# Altium project UZ_CarrierBoard.PrjPcb (part 6 of 10)

## Sheet isoDebug-FTDI.SchDoc
size A4; Organization: UltraZohm; SheetNumber: 32; SheetTotal: 40
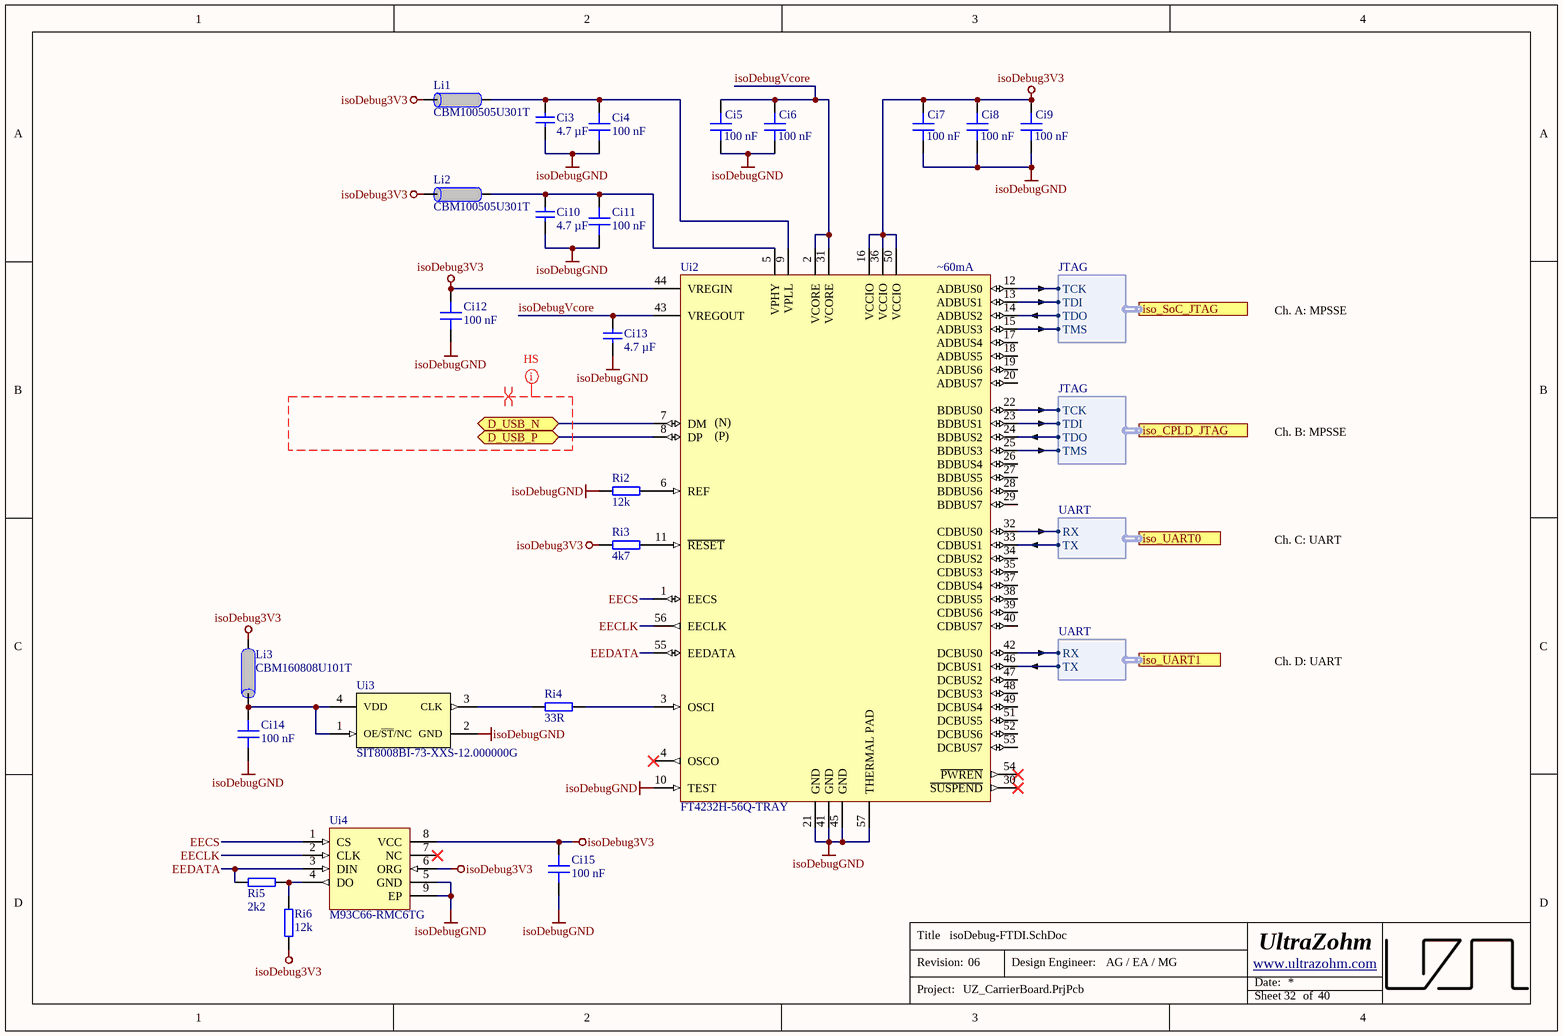
[diagram p19: isoDebug-FTDI.SchDoc]

### Parts
Ci3  4.7 µF  [C_0603_TE]
Ci4  100 nF  [C_0402_TE]
Ci5  100 nF  [C_0402_TE]
Ci6  100 nF  [C_0402_TE]
Ci7  100 nF  [C_0402_TE]
Ci8  100 nF  [C_0402_TE]
Ci9  100 nF  [C_0402_TE]
Ci10  4.7 µF  [C_0603_TE]
Ci11  100 nF  [C_0402_TE]
Ci12  100 nF  [C_0402_TE]
Ci13  4.7 µF  [C_0603_TE]
Ci14  100 nF  [C_0402_TE]
Ci15  100 nF  [C_0402_TE]
Li1  CBM100505U301T  [IND_0402_TE]
Li2  CBM100505U301T  [IND_0402_TE]
Li3  CBM160808U101T  [IND_0603_TE]
Ri2  12k  [R_0603_TE]
Ri3  4k7  [R_0603_TE]
Ri4  33R  [R_0603_TE]
Ri5  2k2  [R_0603_TE]
Ri6  12k  [R_0603_TE]
Ui2  FT4232H-56Q-TRAY  [QFN50P800X800-57T610X610N]
Ui3  SIT8008BI-73-XXS-12.000000G  [2016]
Ui4  M93C66-RMC6TG  [UFDFPN8]

### Ports
D_USB_N (bidir), D_USB_P (bidir), iso_CPLD_JTAG (harness JTAG), iso_SoC_JTAG (harness JTAG), iso_UART0 (harness UART), iso_UART1 (harness UART)

### Harnesses
JTAG: TCK, TDI, TDO, TMS
UART: RX, TX

### Nets
isoDebug3V3: Ci7.2 Ci8.2 Ci9.2 Ci12.2 Ci15.2 Li1.2 Li2.2 Li3.1 Ri3.1 Ri6.1 Ui2.16(VCCIO) Ui2.36(VCCIO) Ui2.44(VREGIN) Ui2.50(VCCIO) Ui4.6(ORG) Ui4.8(VCC)
isoDebugGND: Ci3.1 Ci4.1 Ci5.1 Ci6.1 Ci7.1 Ci8.1 Ci9.1 Ci10.1 Ci11.1 Ci12.1 Ci13.1 Ci14.1 Ci15.1 Ri2.1 Ui2.10(TEST) Ui2.21(GND) Ui2.41(GND) Ui2.45(GND) Ui2.57(THERMAL_PAD) Ui3.2(GND) Ui4.5(GND) Ui4.9(EP)
D_USB_N: Ui2.7(DM) ; port D_USB_N
D_USB_P: Ui2.8(DP) ; port D_USB_P
EECLK: Ui2.56(EECLK) Ui4.2(CLK)
EECS: Ui2.1(EECS) Ui4.1(CS)
EEDATA: Ri5.1 Ui2.55(EEDATA) Ui4.3(DIN)
isoDebugVcore: Ci5.2 Ci6.2 Ci13.2 Ui2.2(VCORE) Ui2.31(VCORE) Ui2.43(VREGOUT)
NetCi3_2: Ci3.2 Ci4.2 Li1.1 Ui2.9(VPLL)
NetCi10_2: Ci10.2 Ci11.2 Li2.1 Ui2.5(VPHY)
NetCi14_2: Ci14.2 Li3.2 Ui3.1(OE/~{ST}/NC) Ui3.4(VDD)
NetRi2_2: Ri2.2 Ui2.6(REF)
NetRi3_2: Ri3.2 Ui2.11(~{RESET})
NetRi4_1: Ri4.1 Ui3.3(CLK)
NetRi4_2: Ri4.2 Ui2.3(OSCI)
NetRi5_2: Ri5.2 Ri6.2 Ui4.4(DO)
NetUi2_12: Ui2.12(ADBUS0) ; port iso_SoC_JTAG.TCK
NetUi2_13: Ui2.13(ADBUS1) ; port iso_SoC_JTAG.TDI
NetUi2_14: Ui2.14(ADBUS2) ; port iso_SoC_JTAG.TDO
NetUi2_15: Ui2.15(ADBUS3) ; port iso_SoC_JTAG.TMS
NetUi2_22: Ui2.22(BDBUS0) ; port iso_CPLD_JTAG.TCK
NetUi2_23: Ui2.23(BDBUS1) ; port iso_CPLD_JTAG.TDI
NetUi2_24: Ui2.24(BDBUS2) ; port iso_CPLD_JTAG.TDO
NetUi2_25: Ui2.25(BDBUS3) ; port iso_CPLD_JTAG.TMS
NetUi2_32: Ui2.32(CDBUS0) ; port iso_UART0.RX
NetUi2_33: Ui2.33(CDBUS1) ; port iso_UART0.TX
NetUi2_42: Ui2.42(DCBUS0) ; port iso_UART1.RX
NetUi2_46: Ui2.46(DCBUS1) ; port iso_UART1.TX

Not connected (* = marked no-connect by the designer): Ui2 4(OSCO)* 17(ADBUS4) 18(ADBUS5) 19(ADBUS6) 20(ADBUS7) 26(BDBUS4) 27(BDBUS5) 28(BDBUS6) 29(BDBUS7) 30(~{SUSPEND})* 34(CDBUS2) 35(CDBUS3) 37(CDBUS4) 38(CDBUS5) 39(CDBUS6) 40(CDBUS7) 47(DCBUS2) 48(DCBUS3) 49(DCBUS4) 51(DCBUS5) 52(DCBUS6) 53(DCBUS7) 54(~{PWREN})*; Ui4 7(NC)*

### Layout directives
differential pair: (no net found under the mark)
net class HS: (no net found under the mark)

### Notes on the sheet
- (near Ui2) ~60mA
- Ch. A: MPSSE
- Ch. B: MPSSE
- Ch. C: UART
- Ch. D: UART
- Title
- Revision:
- Design Engineer:
- Date:
- Project:
- Sheet
- of
- (in symbol FT4232H-56Q-TRAY) (N); (P)

### Library data of the parts
Ci3 Ci10 Ci13 = UZgen_C_0603_4.7uF_16V_X5R: as C11 on sheet ETH-PHY; Manufacturer Part Number: UZgen_C_0603_4.7uF_16V_X5R; PartID: 5809; Created On: 20/03/2025 14:43:45; Device Package: 0603; Last Updated: 20/03/2025 14:43:45; Mounting Type: SMD; Value: 4.7 µF; Technology: X5R
Ci4-Ci9 Ci11 Ci12 Ci14 Ci15 = GRM155R71H104KE14D: 50V 100nF X7R ±10% 0402 Multilayer Ceramic Capacitors MLCC - SMD/SMT ROHS; Manufacturer: Murata Electronics; Voltage Rating: 50 VDC; Created from: AGeiger; Manufacturer Part Number: GRM155R71H104KE14D; PartID: 144; Created On: 13.12.2023 22:03:54; ComponentLink1Description: Datasheet; ComponentLink1URL: https://datasheet.lcsc.com/lcsc/1809272047_Murata-Electronics-GRM155R71H104KE14D_C77020.pdf; Component Type: Capacitor 0402; Device Package: 0402; Last Updated: 13.12.2023 22:03:54; Mounting Type: SMD; Operating Temperature: -55 to +125°C; Series: X7R; Supplier 1: LCSC; Supplier Part Number 1: C77020; Type: Capacitor; Tolerance: 10 %; Value: 100 nF; Live Cycle Status: 1; LCSC Part Number: C77020
Li1 Li2 = CBM100505U301T: 300mΩ ±25% 300Ω@100MHz 0402 Ferrite Beads ROHS; Manufacturer: FH (Guangdong Fenghua Advanced Tech); DC current: 0.6 A; Value: 300 mOhm; Created from: AGeiger; Manufacturer Part Number: CBM100505U301T; PartID: 20; Created On: 13.12.2023 22:24:41; ComponentLink1Description: Datasheet; ComponentLink1URL: https://datasheet.lcsc.com/lcsc/2304140030_FH--Guangdong-Fenghua-Advanced-Tech-CBM100505U301T_C394406.pdf; Component Type: Ferrite Beads; Device Package: 0402; Last Updated: 13.12.2023 22:24:41; Mounting Type: SMD; Operating Temperature: -40 to +85°C; Supplier 1: LCSC; Supplier Part Number 1: C394406; Type: Ferrite Bead; Live Cycle Status: 1; LCSC Part Number: C394406
Li3 = CBM160808U101T: 60mΩ ±25% 100Ω@100MHz 0603 Ferrite Beads ROHS; Manufacturer: FH (Guangdong Fenghua Advanced Tech); DC current: 2.5 A; Value: 60 mOhm; Created from: AGeiger; Manufacturer Part Number: CBM160808U101T; PartID: 21; Created On: 13.12.2023 22:36:14; ComponentLink1Description: Datasheet; ComponentLink1URL: https://datasheet.lcsc.com/lcsc/1912111437_FH--Guangdong-Fenghua-Advanced-Tech-CBM160808U101T_C361675.pdf; Component Type: Ferrite Beads; Device Package: 0603; Last Updated: 13.12.2023 22:36:14; Mounting Type: SMD; Operating Temperature: -40 to +85°C; Supplier 1: LCSC; Supplier Part Number 1: C361675; Type: Ferrite Bead; Live Cycle Status: 1; LCSC Part Number: C361675
Ri2 Ri6 = UZgen_R_0603_12k: Generic resistor; Manufacturer: UZgen; Tolerance: 1 %; Created from: UZgenTool; Manufacturer Part Number: UZgen_R_0603_12k; PartID: 246; Created On: 02/07/2024 17:29:50; Device Package: 0603; Last Updated: 02/07/2024 17:29:50; Mounting Type: SMD; Value: 12k
Ri3 = UZgen_R_0603_4k7: Generic resistor; Manufacturer: UZgen; Tolerance: 1 %; Created from: UZgenTool; Manufacturer Part Number: UZgen_R_0603_4k7; PartID: 237; Created On: 02/07/2024 17:29:50; Device Package: 0603; Last Updated: 02/07/2024 17:29:50; Mounting Type: SMD; Value: 4k7
Ri4 = UZgen_R_0603_33R: as R49 on sheet ETH-PHY; Manufacturer Part Number: UZgen_R_0603_33R; PartID: 185; Created On: 02/07/2024 17:29:48; Device Package: 0603; Last Updated: 02/07/2024 17:29:48; Mounting Type: SMD; Value: 33R
Ri5 = UZgen_R_0603_2k2: Generic resistor; Manufacturer: UZgen; Tolerance: 1 %; Created from: UZgenTool; Manufacturer Part Number: UZgen_R_0603_2k2; PartID: 229; Created On: 02/07/2024 17:29:49; Device Package: 0603; Last Updated: 02/07/2024 17:29:49; Mounting Type: SMD; Value: 2k2
Ui2 = FT4232H-56Q-TRAY: USB Interface IC Quad 480Mbs 4 UART USB 2.0 12Mbit; Manufacturer: FTDI; Created from: AGeiger; PartID: 1; Created On: 26.11.2023 16:58:07; ComponentLink1Description: Datasheet; ComponentLink1URL: https://www.mouser.de/datasheet/2/163/DS_FT4232H-1621254.pdf; Component Type: USB Controller; Device Package: VQFN-56; Last Updated: 26.11.2023 16:58:07; Manufacturer Part Number: FT4232H-56Q-TRAY; Mounting Type: SMD; Operating Temperature: -40 to 85 °C; Series: FT4232H; Supplier 1: Mouser; Supplier Part Number 1: 895-FT4232H-56Q-TRAY; Value: FT4232H-56Q-TRAY; LCSC Part Number: C1521561
Ui3 = SIT8008BI-73-XXS-12.000000G: Clock-Standardoszillatoren -40 to 85C, 2016, 50ppm, 2.25V-3.63V, 12MHz, ST, 250 pcs T&R 8 mm; Manufacturer: SiTime; Created from: AGeiger; Manufacturer Part Number: SIT8008BI-73-XXS-12.000000G; PartID: 2; Created On: 11.01.2024 17:02:48; ComponentLink1Description: Datasheet; ComponentLink1URL: https://www.mouser.de/datasheet/2/371/SiT8008B_datasheet-1291019.pdf; Component Type: Oscillator; Device Package: 2016; Last Updated: 11.01.2024 17:02:48; Mounting Type: SMD; Operating Temperature: -40 to +85 °C; Supplier 1: Mouser; Supplier Part Number 1: 788-8008BI73XXS120G; Value: 12 MHz; LCSC Part Number: C1508636
Ui4 = M93C66-RMC6TG: 4Kbit MICROWIRE EE 1.8 V to 5.5 V; Manufacturer: STMicroelectronics; Created from: AGeiger; Manufacturer Part Number: M93C66-RMC6TG; PartID: 2; Created On: 19.11.2023 15:06:30; ComponentLink1Description: Datasheet; ComponentLink1URL: https://www.mouser.de/datasheet/2/389/m93c46_w-1849748.pdf; Component Type: EEPROM; Device Package: UFDFPN-8; Last Updated: 19.11.2023 21:39:04; Mounting Type: SMD; Operating Temperature: -40 to +85 °C; Series: M93xxx; Supplier 1: Mouser; Supplier Part Number 1: 511-M93C66-RMC6TG; Supplier 2: LCSC; Supplier Part Number 2: C2061956; Type: Memory; Value: M93C66-RMC6TG; LCSC Part Number: C2061956

## Sheet isoDebug-Isolation.SchDoc
size A4; Organization: UltraZohm
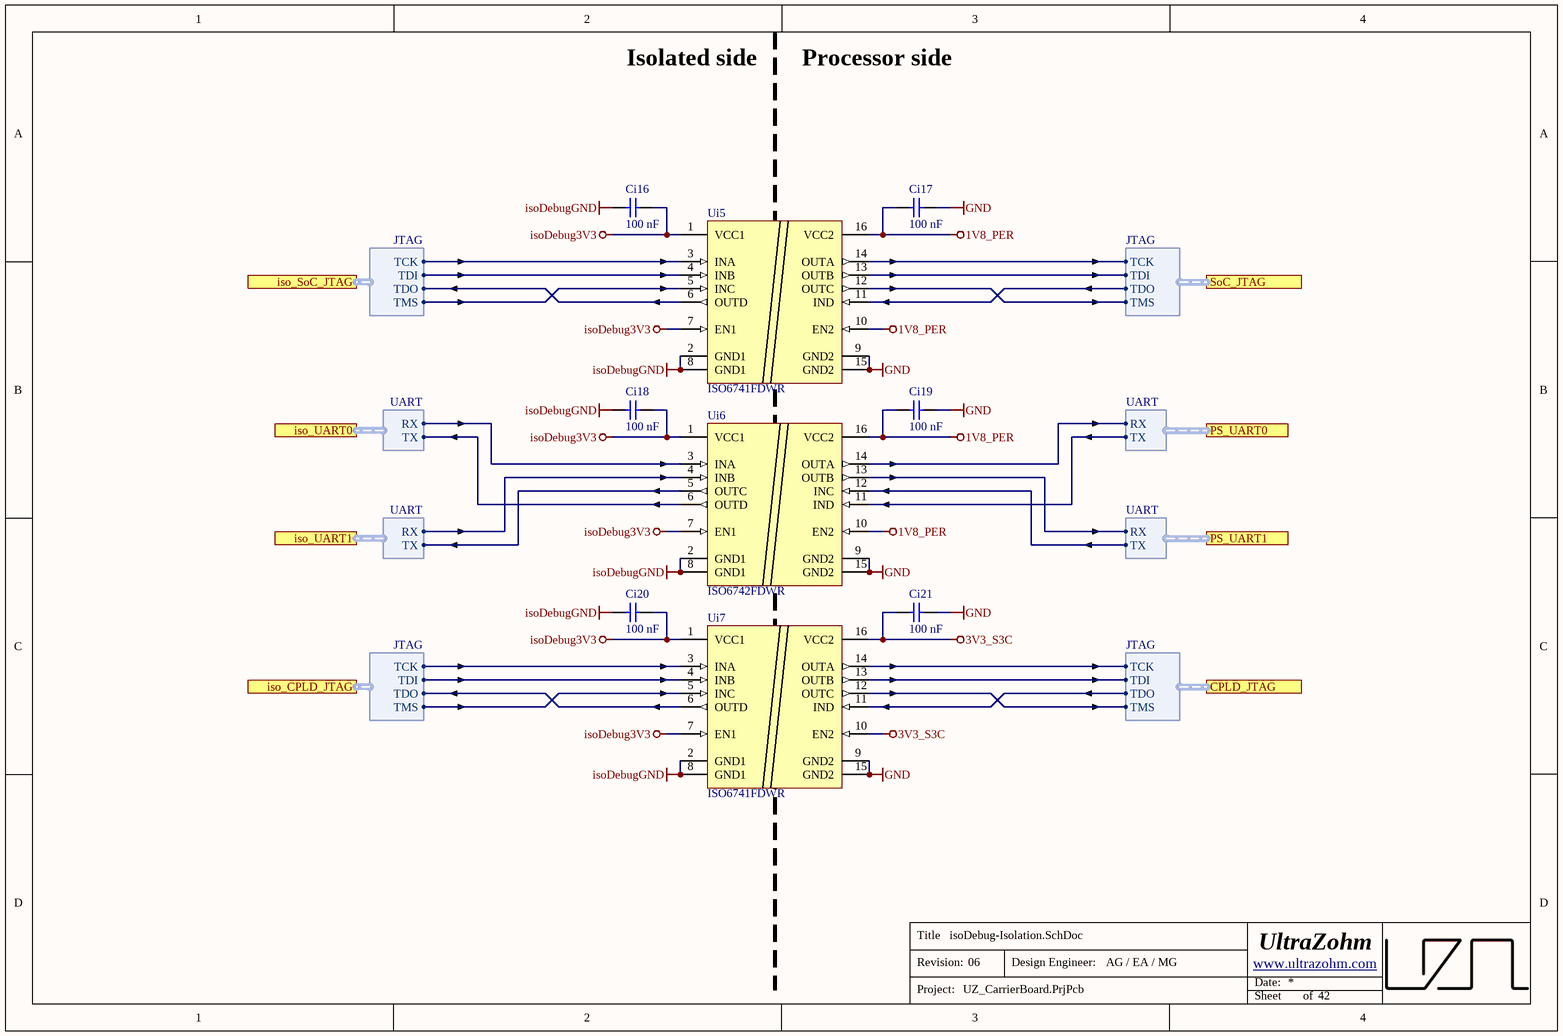
[diagram p20: isoDebug-Isolation.SchDoc]

### Parts
Ci16  100 nF  [C_0402_TE]
Ci17  100 nF  [C_0402_TE]
Ci18  100 nF  [C_0402_TE]
Ci19  100 nF  [C_0402_TE]
Ci20  100 nF  [C_0402_TE]
Ci21  100 nF  [C_0402_TE]
Ui5  ISO6741FDWR  [SOIC127P1030X265-16N]
Ui6  ISO6742FDWR  [SOIC127P1030X265-16N]
Ui7  ISO6741FDWR  [SOIC127P1030X265-16N]

### Ports
CPLD_JTAG (harness JTAG), iso_CPLD_JTAG (harness JTAG), iso_SoC_JTAG (harness JTAG), iso_UART0 (harness UART), iso_UART1 (harness UART), PS_UART0 (harness UART), PS_UART1 (harness UART), SoC_JTAG (harness JTAG)

### Harnesses
JTAG: TCK, TDI, TDO, TMS
UART: RX, TX

### Nets
1V8_PER: Ci17.2 Ci19.2 Ui5.10(EN2) Ui5.16(VCC2) Ui6.10(EN2) Ui6.16(VCC2)
3V3_S3C: Ci21.2 Ui7.10(EN2) Ui7.16(VCC2)
GND: Ci17.1 Ci19.1 Ci21.1 Ui5.9(GND2) Ui5.15(GND2) Ui6.9(GND2) Ui6.15(GND2) Ui7.9(GND2) Ui7.15(GND2)
isoDebug3V3: Ci16.1 Ci18.1 Ci20.1 Ui5.1(VCC1) Ui5.7(EN1) Ui6.1(VCC1) Ui6.7(EN1) Ui7.1(VCC1) Ui7.7(EN1)
isoDebugGND: Ci16.2 Ci18.2 Ci20.2 Ui5.2(GND1) Ui5.8(GND1) Ui6.2(GND1) Ui6.8(GND1) Ui7.2(GND1) Ui7.8(GND1)
PS_UART0_RX: Ui6.14(OUTA) ; port PS_UART0.RX
PS_UART0_TX: Ui6.11(IND) ; port PS_UART0.TX
PS_UART1_RX: Ui6.13(OUTB) ; port PS_UART1.RX
PS_UART1_TX: Ui6.12(INC) ; port PS_UART1.TX
TCK: Ui5.14(OUTA) ; port SoC_JTAG.TCK
TDI: Ui5.13(OUTB) ; port SoC_JTAG.TDI
TDO: Ui5.11(IND) ; port SoC_JTAG.TDO
TMS: Ui5.12(OUTC) ; port SoC_JTAG.TMS
NetUi2_12: Ui5.3(INA) ; port iso_SoC_JTAG.TCK
NetUi2_13: Ui5.4(INB) ; port iso_SoC_JTAG.TDI
NetUi2_14: Ui5.6(OUTD) ; port iso_SoC_JTAG.TDO
NetUi2_15: Ui5.5(INC) ; port iso_SoC_JTAG.TMS
NetUi2_22: Ui7.3(INA) ; port iso_CPLD_JTAG.TCK
NetUi2_23: Ui7.4(INB) ; port iso_CPLD_JTAG.TDI
NetUi2_24: Ui7.6(OUTD) ; port iso_CPLD_JTAG.TDO
NetUi2_25: Ui7.5(INC) ; port iso_CPLD_JTAG.TMS
NetUi2_32: Ui6.3(INA) ; port iso_UART0.RX
NetUi2_33: Ui6.6(OUTD) ; port iso_UART0.TX
NetUi2_42: Ui6.4(INB) ; port iso_UART1.RX
NetUi2_46: Ui6.5(OUTC) ; port iso_UART1.TX
NetUi7_11: Ui7.11(IND) ; port CPLD_JTAG.TDO
NetUi7_12: Ui7.12(OUTC) ; port CPLD_JTAG.TMS
NetUi7_13: Ui7.13(OUTB) ; port CPLD_JTAG.TDI
NetUi7_14: Ui7.14(OUTA) ; port CPLD_JTAG.TCK

### Notes on the sheet
- Isolated side
- Processor side
- Title
- Revision:
- Design Engineer:
- Date:
- Project:
- Sheet
- of

### Library data of the parts
Ci16-Ci21 = UZgen_C_0402_100nF_50V_X7R: Generic capacitor; Manufacturer: UZgen; Tolerance: 10 %; Created from: UZgenTool; Voltage: 50V; Manufacturer Part Number: UZgen_C_0402_100nF_50V_X7R; PartID: 3431; Created On: 02/08/2024 11:17:51; Device Package: 0402; Last Updated: 02/08/2024 11:17:51; Mounting Type: SMD; Value: 100 nF; Technology: X7R
Ui5 Ui7 = ISO6741FDWR: Digital Isolators General-purpose, quad-channel, 3/1 digital isolator 16-SOIC -40 to 125; Manufacturer: Texas Instruments; Created from: FRosner; Manufacturer Part Number: ISO6741FDWR; PartID: 6; Created On: 18/06/2024 13:06:34; ComponentLink1Description: Datasheet; ComponentLink1URL: https://www.ti.com/lit/ds/symlink/iso6741.pdf?ts=1718698076011&ref_url=https%253A%252F%252Fwww.ti.com%252Fproduct%252FISO6741; Component Type: Digital Isolator; Device Package: SOIC-16; Last Updated: 28/06/2024 13:30:42; Mounting Type: SMD; Operating Temperature: -40 to +125 °C; Series: ISO6741; Supplier 1: Mouser; Supplier Part Number 1: 595-ISO6741FDWR; Type: Digital Isolator; Value: ISO6741FDWR; LCSC Part Number: C5216433; Supplier 2: LCSC; Supplier Part Number 2: C5216433
Ui6 = ISO6742FDWR: Digital Isolators General-purpose, quad-channel, 2/2 digital isolator; Manufacturer: Texas Instruments; Created from: FRosner; Manufacturer Part Number: ISO6742FDWR; PartID: 5; Created On: 18/06/2024 12:17:11; ComponentLink1Description: Datasheet; ComponentLink1URL: https://www.ti.com/lit/ds/symlink/iso6742.pdf?ts=1718696457648&ref_url=https%253A%252F%252Fwww.mouser.de%252F; Component Type: Digital Isolator; Device Package: SOIC-16; Last Updated: 18/06/2024 14:14:19; Mounting Type: SMD; Operating Temperature: -40 to +125 °C; Series: ISO6742; Supplier 1: Mouser; Supplier Part Number 1: 595-ISO6742FDWR; Type: Digital Isolator; Value: ISO6742FDWR; LCSC Part Number: C5216408; Supplier 2: LCSC; Supplier Part Number 2: C5216408

## Sheet Frontpanel.SchDoc
size A4; Author: AG / EA / MG; CompanyName: Technische Hochschule Nürnberg Georg Simon Ohm; Organization: UltraZohm; Address1: Kesslerplatz 12; Address2: 90489 Nürnberg; Address3: GERMANY; SheetNumber: 24; SheetTotal: 36; Website: www.ultrazohm.com
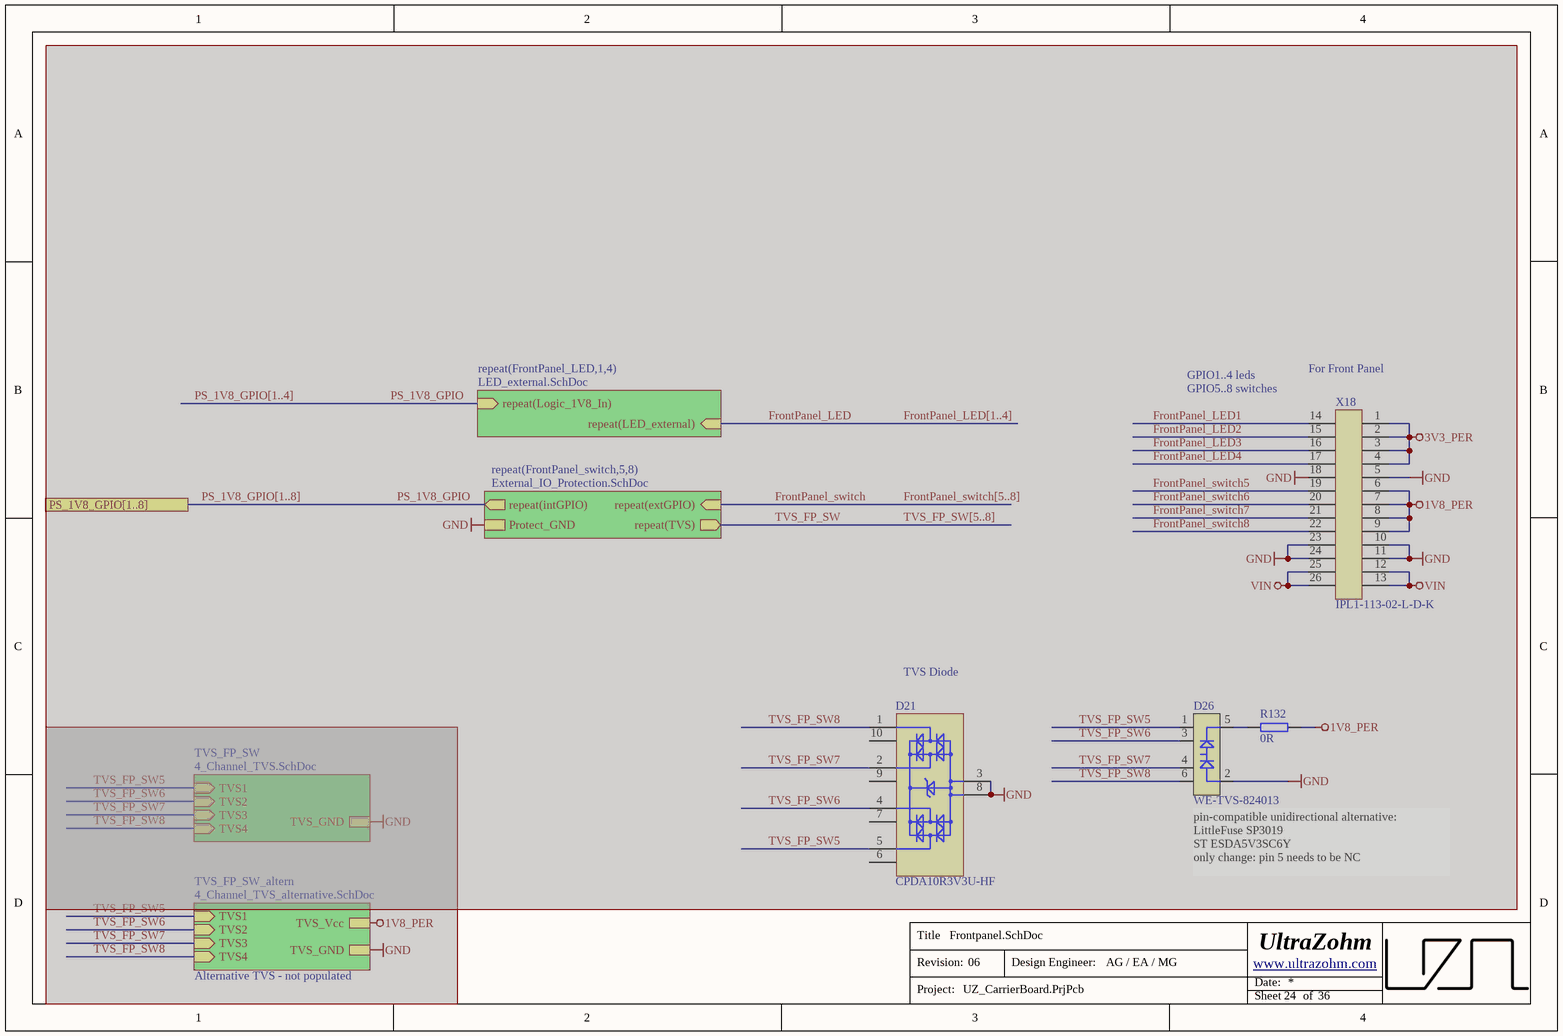
[diagram p21: Frontpanel.SchDoc]

### Parts
D21  CPDA10R3V3U-HF  [DFN230X100X55X10N]  (masked out: inside a compile mask, not in the netlist)
D26  WE-TVS-824013  [SOT95P280X145-6N]  (masked out: inside a compile mask, not in the netlist)
R132  0R  [R_0603_TE]  (masked out: inside a compile mask, not in the netlist)
X18  IPL1-113-02-L-D-K  [IPL1-113-02-L-D-K]  (masked out: inside a compile mask, not in the netlist)

### Sub-sheets
repeat(FrontPanel_LED,1,4) = LED_external.SchDoc (masked out) (file not in this document): repeat(LED_external) (in), repeat(Logic_1V8_In) (in)
repeat(FrontPanel_switch,5,8) = External_IO_Protection.SchDoc (masked out) (file not in this document): repeat(extGPIO) (in), repeat(intGPIO) (out), repeat(TVS) (out), Protect_GND
TVS_FP_SW = 4_Channel_TVS.SchDoc (masked out) (file not in this document): TVS_GND, TVS1 (in), TVS2 (in), TVS3 (in), TVS4 (in)
TVS_FP_SW_altern = 4_Channel_TVS_alternative.SchDoc (masked out) (file not in this document): TVS_GND, TVS1 (in), TVS2 (in), TVS3 (in), TVS4 (in), TVS_Vcc

### Ports
PS_1V8_GPIO[1..8]

### Notes on the sheet
- GPIO1..4 leds
- (near X18) For Front Panel
- (near X18) GPIO5..8 switches
- (near D21) TVS Diode
- (near D26) pin-compatible unidirectional alternative:
  LittleFuse SP3019
  ST ESDA5V3SC6Y
  only change: pin 5 needs to be NC
- Alternative TVS - not populated
- Title
- Revision:
- Design Engineer:
- Date:
- Project:
- Sheet
- of

### Library data of the parts
D21 = 29054: AN: 29054; Voltage: 3.3V; Mixed: SMT; Temperature-Range: -55/+125; Extra: Diode Array TVS Diode ESD Protection 4-channel; Case: TSLP-9-1; HelpURL: b:\AD\adlib\datasheet\CPDA10R3V3U-HF\; H-ART: CPDA10R3V3U-HF
D26 = 23986: TVS/Clamp Diode Array 3.3/9V Quad SOT23-6; AN: 23986; Mixed: SMT; Trenz-Stock: Yes; H-ART: 824013; Extra: ESD Protection for 4 lines, Low capacitance; Case: SOT23-6; HelpURL: B:\AD\adlib\datasheet\WE-TVS-824013; Preferred: Yes
R132 = UZgen_R_0603_0R: as R26 on sheet J4-B64+B65; Value: 0R; Manufacturer Part Number: UZgen_R_0603_0R; PartID: 581; Created On: 08.07.2024 14:34:30; Device Package: 0603; Mounting Type: SMD; Last Updated: 08.07.2024 14:34:30
X18 = 30828: AN: 30828; Mixed: SMT; Temperature-Range: -55/+125; Extra: Connector Header IPL1, 2-row 26pos, key polarization, SMT 0°; Case: IPL1; HelpURL: b:\AD\adlib\datasheet\Samtec\IPL1-SMT\; H-ART: IPL1-113-02-L-D-K

## Sheet Thermal.SchDoc
size A4; Organization: UltraZohm; SheetNumber: 34; SheetTotal: 40
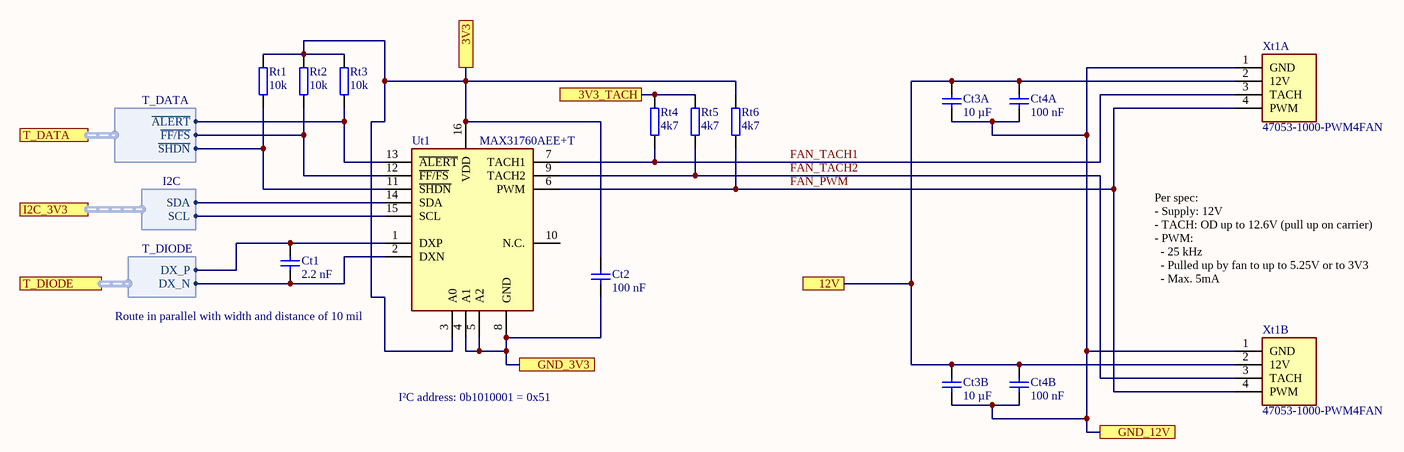
[diagram p22: Thermal.SchDoc]

### Parts
Ct1  2.2 nF  [C_0603_TE]
Ct2  100 nF  [C_0603_TE]
Ct3A  10 µF  [C_1206_TE]
Ct3B  10 µF  [C_1206_TE]
Ct4A  100 nF  [C_0603_TE]
Ct4B  100 nF  [C_0603_TE]
Rt1  10k  [R_0603_TE]
Rt2  10k  [R_0603_TE]
Rt3  10k  [R_0603_TE]
Rt4  4k7  [R_0603_TE]
Rt5  4k7  [R_0603_TE]
Rt6  4k7  [R_0603_TE]
Ut1  MAX31760AEE+T  [SOP64P602X175-16N]
Xt1A  47053-1000-PWM4FAN  [470531000]
Xt1B  47053-1000-PWM4FAN  [470531000]

### Ports
3V3, 3V3_TACH, 12V, GND_3V3, GND_12V, I2C_3V3 (harness I2C), T_DATA (harness T_DATA), T_DIODE (harness T_DIODE)

### Harnesses
I2C: SCL, SDA
T_DIODE: DX_P, DX_N
T_DATA: ~{ALERT}, ~{FF/FS}, ~{SHDN}

### Nets
3V3_PER: Ct2.2 Rt1.2 Rt2.2 Rt3.2 Rt4.2 Rt5.2 Rt6.2 Ut1.3(A0) Ut1.16(VDD) ; port 3V3, port 3V3_TACH
GND: Ct2.1 Ct3A.1 Ct3B.1 Ct4A.1 Ct4B.1 Ut1.4(A1) Ut1.5(A2) Ut1.8(GND) Xt1A.1(GND) Xt1B.1(GND) ; port GND_3V3, port GND_12V
12V_FAN: Ct3A.2 Ct3B.2 Ct4A.2 Ct4B.2 Xt1A.2(12V) Xt1B.2(12V) ; port 12V
FAN_PWM: Rt6.1 Ut1.6(PWM) Xt1A.4(PWM) Xt1B.4(PWM)
FAN_TACH1: Rt4.1 Ut1.7(TACH1) Xt1A.3(TACH)
FAN_TACH2: Rt5.1 Ut1.9(TACH2) Xt1B.3(TACH)
SOM_TEMPSENS.DX_N: Ct1.1 Ut1.2(DXN) ; port T_DIODE.DX_N
SOM_TEMPSENS.DX_P: Ct1.2 Ut1.1(DXP) ; port T_DIODE.DX_P
THERMAL_DATA.~{ALERT}: Rt3.1 Ut1.13(~{ALERT}) ; port T_DATA.~{ALERT}
THERMAL_DATA.~{FF/FS}: Rt2.1 Ut1.12(~{FF/FS}) ; port T_DATA.~{FF/FS}
THERMAL_DATA.~{SHDN}: Rt1.1 Ut1.11(~{SHDN}) ; port T_DATA.~{SHDN}
NetR37A_1: Ut1.15(SCL) ; port I2C_3V3.SCL
NetR38A_1: Ut1.14(SDA) ; port I2C_3V3.SDA

Not connected (* = marked no-connect by the designer): Ut1 10(N.C.)

### Notes on the sheet
- (near Ut1) Route in parallel with width and distance of 10 mil
- Per spec:
  - Supply: 12V
  - TACH: OD up to 12.6V (pull up on carrier)
  - PWM:
  - 25 kHz
  - Pulled up by fan to up to 5.25V or to 3V3
  - Max. 5mA
- I²C address: 0b1010001 = 0x51
- Title
- Revision:
- Design Engineer:
- Date:
- Project:
- Sheet
- of

### Library data of the parts
Ct1 = UZgen_C_0603_2.2nF_50V_X7R: Generic capacitor; Manufacturer: UZgen; Voltage: 50V; Tolerance: 10 %; Created from: UZgenTool; Manufacturer Part Number: UZgen_C_0603_2.2nF_50V_X7R; PartID: 4247; Created On: 02/08/2024 11:18:09; Value: 2.2 nF; Device Package: 0603; Technology: X7R; Mounting Type: SMD; Last Updated: 02/08/2024 11:18:09
Ct2 Ct4A Ct4B = UZgen_C_0603_100nF_50V_X7R: Generic capacitor; Manufacturer: UZgen; Voltage: 50V; Tolerance: 10 %; Created from: AGeiger; Manufacturer Part Number: UZgen_C_0603_100nF_50V_X7R; PartID: 1; Created On: 02/07/2024 14:42:23; Value: 100 nF; Device Package: 0603; Technology: X7R; Mounting Type: SMD; Last Updated: 08/08/2024 15:01:15
Ct3A Ct3B = UZgen_C_1206_10uF_50V_X7R: Generic capacitor; Manufacturer: UZgen; Tolerance: 10 %; Created from: MGeier; Voltage: 50V; Manufacturer Part Number: UZgen_C_1206_10uF_50V_X7R; PartID: 5807; Created On: 20/03/2025 14:05:00; Device Package: 1206; Last Updated: 20/03/2025 14:05:00; Mounting Type: SMD; Value: 10 µF; Technology: X7R
Rt1-Rt3 = UZgen_R_0603_10k: as R51 on sheet ETH-PHY; Manufacturer Part Number: UZgen_R_0603_10k; PartID: 1; Created On: 02/07/2024 14:34:53; Value: 10k; Device Package: 0603; Mounting Type: SMD; Last Updated: 02/07/2024 14:37:16
Rt4-Rt6 = UZgen_R_0603_4k7: as Ri3 on sheet isoDebug-FTDI; Manufacturer Part Number: UZgen_R_0603_4k7; PartID: 237; Created On: 02/07/2024 17:29:50; Value: 4k7; Device Package: 0603; Mounting Type: SMD; Last Updated: 02/07/2024 17:29:50
Ut1 = MAX31760AEE+T: Motor/Motion/Ignition Controllers & Drivers Fan Speed Controller with LUT t&r; Manufacturer: Analog Devices Inc.; Created from: FRosner; Manufacturer Part Number: MAX31760AEE+T; PartID: 18; Created On: 02/07/2024 15:15:09; ComponentLink1Description: Datasheet; ComponentLink1URL: https://www.analog.com/media/en/technical-documentation/data-sheets/MAX31760.pdf; Component Type: Fan Controller; Device Package: QSOP-16; Last Updated: 04/09/2024 11:48:15; Mounting Type: SMD/SMT; Operating Temperature: -40 - 125 °C; Series: MAX31760; Supplier 1: Mouser; Supplier Part Number 1: 700-MAX31760AEE+T; Supplier 2: LCSC; Supplier Part Number 2: C3031567; Type: Driver; Live Cycle Status: 1; LCSC Part Number: C3031567; Stock number: not stored
Xt1A Xt1B = 47053-1000-PWM4FAN: Headers & Wire Housings 4P VERT HDR W/FL; Manufacturer_Name: Molex; Created from: FRosner; Number of positions: 4; Datasheet Link: http://www.molex.com/pdm_docs/sd/470531000_sd.pdf; Height: 8mm; Manufacturer_Part_Number: 47053-1000; Mouser Part Number: 538-47053-1000; Mouser Price/Stock: https://www.mouser.co.uk/ProductDetail/Molex/47053-1000?qs=ph4zPCVRuvqoDX7hrEhxNA%3D%3D; Manufacturer Part Number: 47053-1000-PWM4FAN; PartID: 17; Created On: 21/08/2024 08:09:57; ComponentLink1Description: Datasheet; ComponentLink1URL: https://tools.molex.com/pdm_docs/sd/470531000_sd.pdf; Component Type: Pin Header; Device Package: THT; Last Updated: 04/09/2024 14:33:45; Manufacturer: Molex; Mounting Type: THT; Series: 47053; Supplier 1: Mouser; Supplier Part Number 1: 538-47053-1000; Supplier 2: LCSC; Supplier Part Number 2: C240840; Type: Pin Header; Live Cycle Status: 1; LCSC Part Number: C240840; Stock number: not stored; Number of rows: 1